# EAGLE design Hi Impedance Voltage Divider v1.1 (EAGLE 7.7.0)
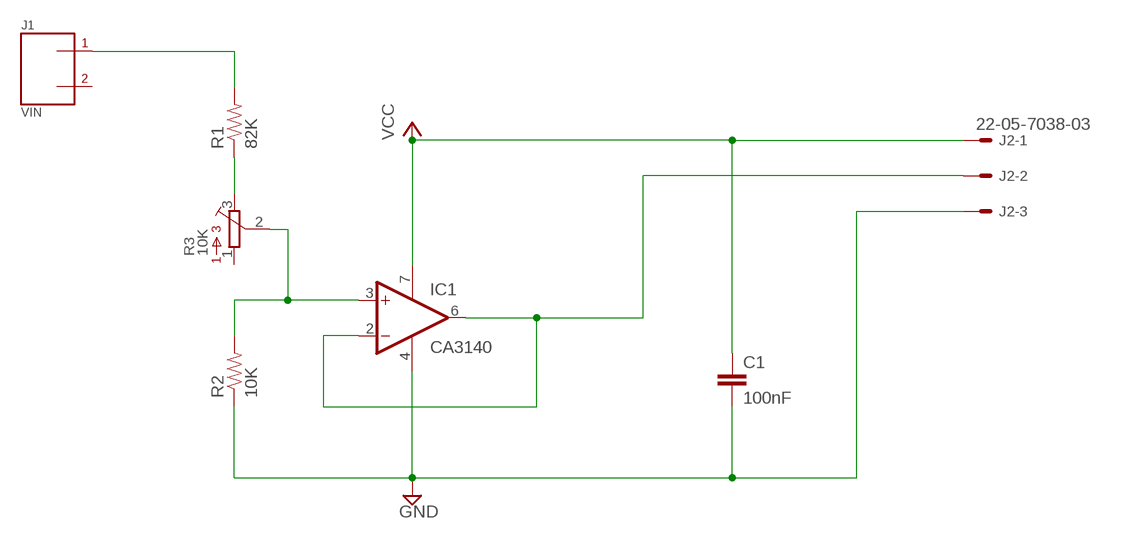
[diagram p0: schematic, sheet 1]

## Parts
C1  100nF  CAPPTH1  [CAP-PTH-5MM]
IC1  CA3140  1AMP_P7+4N  [DIL08]
J1  VIN  J2-508MM  [J2-508MM]
J2  22-05-7038-03  [7395-03]
R1  82K  RESISTORAXIAL-0.3  [AXIAL-0.3]
R2  10K  RESISTORAXIAL-0.3  [AXIAL-0.3]
R3  10K  3386-W  [3386W]

## Nets
GND: C1.2 IC1.4(V-) J2.3 R2.P$1
N$1: J1.P$1 R1.P$2
N$2: R1.P$1 R3.3
N$3: IC1.3(+IN) R2.P$2 R3.2
N$6: IC1.2(-IN) IC1.6(OUT) J2.2
VCC: C1.1 IC1.7(V+) J2.1
Unconnected: J1.P$2 R3.1

## Library data of the parts
C1 = SparkFun:CAP: Capacitor Standard 0603 ceramic capacitor, and 0.1" leaded capacitor.
IC1 = linear:1AMP_P7+4: OP AMP
J1 = aaa-flatcatit:J2-508MM: J2 5.08mm 12A Connector
J2 = con-molex:22-?-03: CONNECTOR wire to board 2.54 mm (.1 inch) pitch header; OC_FARNELL: unknown; OC_NEWARK: unknown
R1 R2 = SparkFun:RESISTOR: Resistor Basic schematic elements and footprints for 0603, 1206, and PTH resistors.
R3 = bourns:3386-: 3386 Series 3/8" Square Trimmer

## Board
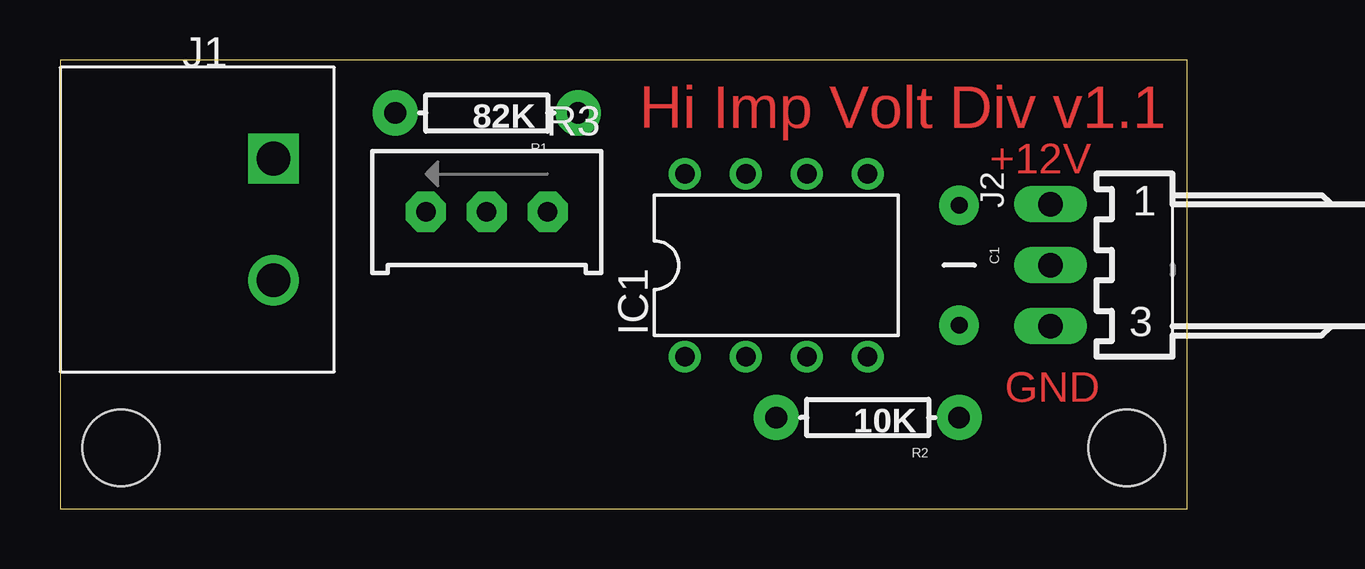
[diagram p1: board, top side]
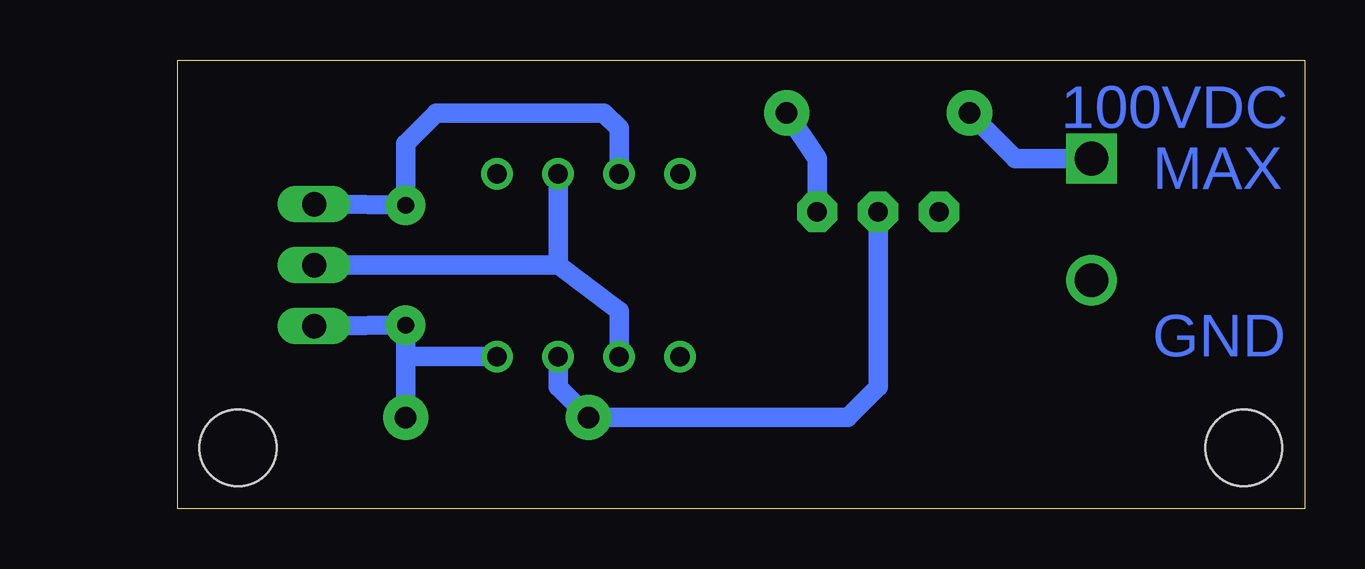
[diagram p2: board, bottom side, seen from below]

Size 46.97 x 18.72 mm. Coordinates in mm from the lower left corner, seen from the top.
Outline: 0,0 46.97,0 46.97,18.72 0,18.72 0,0
Copper layers (1*16): Top 0.035mm / dielectric 1.5mm / Bottom 0.035mm
Design rules "default": minimum track width 10mil, minimum drill 24mil, track to track 8mil, track to pad 8mil, pad to pad 8mil, via to via 8mil, smd to smd 8mil, copper to edge 40mil, drill to drill 8mil, minimum pad ring 10mil, minimum via ring 8mil, stop-mask expansion 4mil, vias tented up to drill 0mil, thermal gap 10mil
Holes 3.2 mm at 44.45,2.54 2.54,2.54

### Footprints (pad centres in the part's own frame; a part is rotated, then mirrored left to right if it is on the bottom)
CAP-PTH-5MM = drill 0.7 pad 1.651: 1 -2.5,0; 2 2.5,0
DIL08 = drill 0.813 pad 1.27: 1 -3.81,-3.81; 2 -1.27,-3.81; 3 1.27,-3.81; 4 3.81,-3.81; 5 3.81,3.81; 6 1.27,3.81; 7 -1.27,3.81; 8 -3.81,3.81
J2-508MM = drill 1.4 square: P$1 0,0 | drill 1.4: P$2 5.08,0
7395-03 = drill 1.016 long: 1 2.54,0; 2 0,0; 3 -2.54,0
AXIAL-0.3 = drill 0.9 pad 1.88: P$1 -3.81,0; P$2 3.81,0
3386W = drill 0.813 pad 1.676 octagon: 1 2.54,0.318; 2 0,0.318; 3 -2.54,0.318

### Placement (x,y rotation side)
C1  37.47,10.16 270 top
IC1  29.84,10.16 0 top
J1  8.89,14.61 270 top
J2  41.27,10.16 90 top
R1  17.78,16.51 180 top
R2  33.66,3.81 180 top
R3  17.78,12.7 180 top

### Tracks (layer width: path | path; a pad name or v marks a point on that pad's centre or on a via)
GND
  Bottom 0.813: J2.3 40.68,7.62 C1.2 37.47,6.35 | 37.47,6.35 IC1.4 | 37.47,6.35 R2.P$1
N$1
  Bottom 0.813: J1.P$1 12.06,14.61 R1.P$2
N$2
  Bottom 0.813: R3.3 20.32,14.61 R1.P$1
N$3
  Bottom 0.813: R3.2 17.78,5.08 19.05,3.81 R2.P$2 31.11,5.08 IC1.3
N$6
  Bottom 0.813: J2.2 31.11,10.16 | 31.11,10.16 28.57,8.26 IC1.2 | IC1.6 31.11,10.16
VCC
  Bottom 0.813: J2.1 40.68,12.7 C1.1 37.47,15.24 36.2,16.51 29.21,16.51 28.57,15.88 IC1.7

### Text on the board
Top: Hi Imp Volt Div v1.1 | +12V | GND
Bottom: 100VDC | MAX | GND